# EAGLE design Hub_03 (EAGLE 9.6.2)
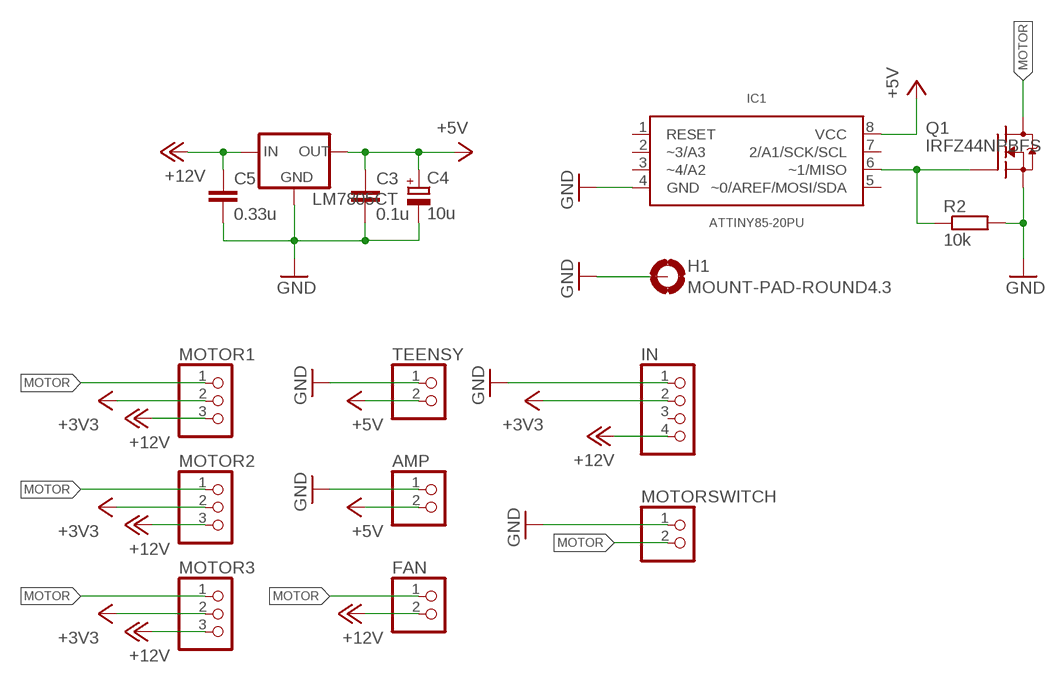
[diagram p0: schematic, sheet 1]

## Parts
AMP  PINHD-1X2  [1X02]
C3  0.1u  C-EU025-024X044  [C025-024X044]
C4  10u  CPOL-EUE2,5-6E  [E2,5-6E]
C5  0.33u  C-EU025-024X044  [C025-024X044]
FAN  PINHD-1X2  [1X02]
H1  MOUNT-PAD-ROUND4.3  [4,3-PAD]
IC1  ATTINY85-20PU  [DIP08]
IN  PINHD-1X4  [1X04]
LM7805CT  78XXS  [78XXS]
MOTOR1  PINHD-1X3  [1X03]
MOTOR2  PINHD-1X3  [1X03]
MOTOR3  PINHD-1X3  [1X03]
MOTORSWITCH  PINHD-1X2  [1X02]
Q1  IRFZ44NPBFS  [TO220-3S]
R2  10k  R-EU_0204/7  [0204/7]
TEENSY  PINHD-1X2  [1X02]

## Nets
+3V3: IN.2 MOTOR1.2 MOTOR2.2 MOTOR3.2
+5V [5V]: AMP.2 C3.1 C4.+ IC1.8(VCC) LM7805CT.OUT TEENSY.2
+12V [12V]: C5.1 FAN.2 IN.4 LM7805CT.IN MOTOR1.3 MOTOR2.3 MOTOR3.3
GND [GND]: AMP.1 C3.2 C4.- C5.2 H1.B4,3(MOUNT) IC1.4(GND) IN.1 LM7805CT.GND MOTORSWITCH.1 Q1.S R2.2 TEENSY.1
MOTOR [GND]: FAN.1 MOTOR1.1 MOTOR2.1 MOTOR3.1 MOTORSWITCH.2 Q1.D
N$1: IC1.6(~1/MISO) Q1.G R2.1
Unconnected: IC1.1(RESET) IC1.2(~3/A3) IC1.3(~4/A2) IC1.5(~0/AREF/MOSI/SDA) IC1.7(2/A1/SCK/SCL) IN.3

## Library data of the parts
AMP FAN MOTORSWITCH TEENSY = pinhead:PINHD-1X2: PIN HEADER
C3 C5 = rcl:C-EU: CAPACITOR, European symbol; SPICEPREFIX: C
C4 = rcl:CPOL-EU: POLARIZED CAPACITOR, European symbol; SPICEPREFIX: C
H1 = holes:MOUNT-PAD-ROUND: MOUNTING PAD, round
IC1 = Programmer:ATTINY85-20PU
IN = pinhead:PINHD-1X4: PIN HEADER
LM7805CT = v-reg:78XXS: VOLTAGE REGULATOR
MOTOR1-MOTOR3 = pinhead:PINHD-1X3: PIN HEADER
Q1 = Programmer:IRFZ44NPBF
R2 = rcl:R-EU_: RESISTOR, European symbol; SPICEPREFIX: R

## Net classes
0 3V3: width 0.203 mm, drill 0.203 mm, clearance 0.152 mm
1 GND: width 0.203 mm, clearance 0.152 mm
2 12V: width 0.813 mm, clearance 0.305 mm
3 5V: width 0.406 mm, clearance 0.152 mm

## Board
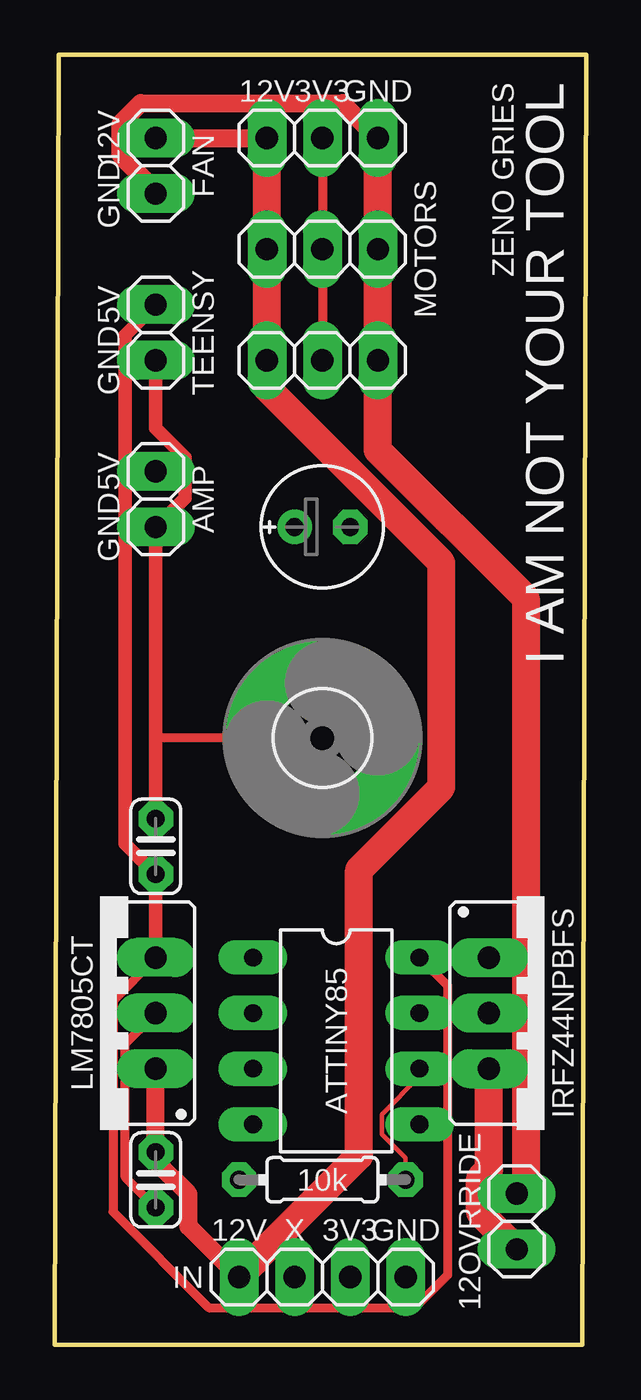
[diagram p1: board, top side]
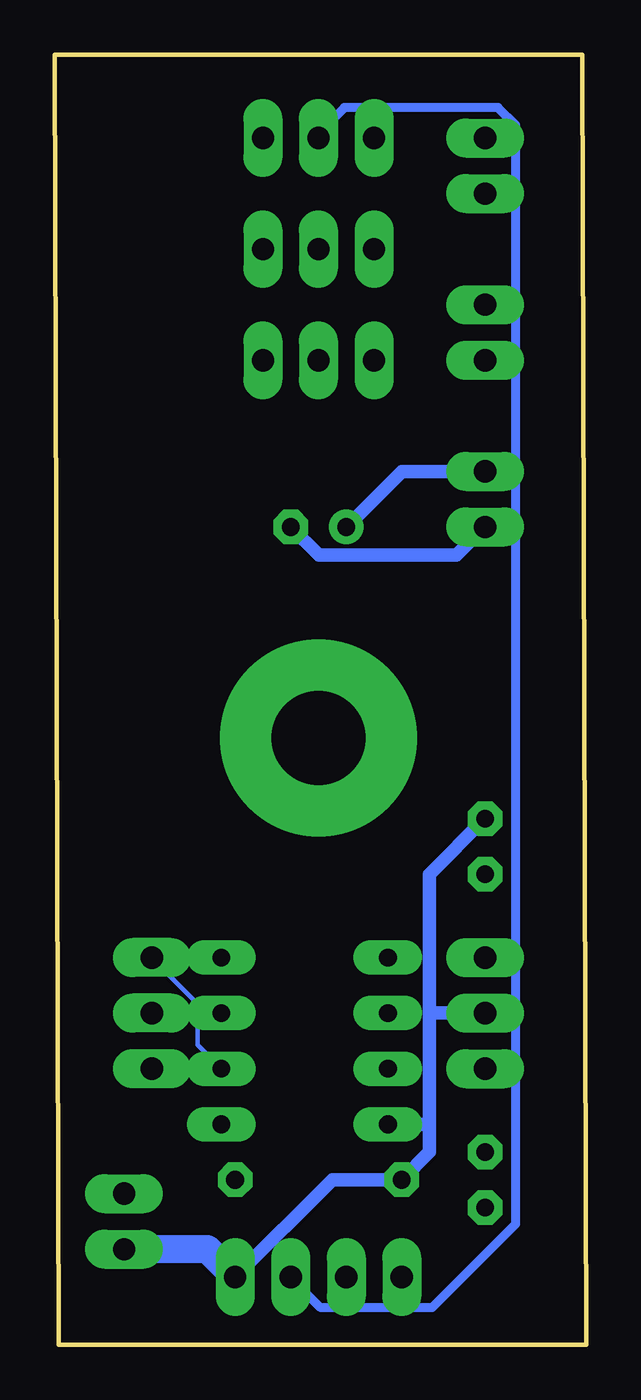
[diagram p2: board, bottom side, seen from below]

Size 24.31 x 58.98 mm. Coordinates in mm from the lower left corner, seen from the top.
Outline: 24.13,0 0,0 0.18,58.98 24.31,58.98 24.13,0
Copper layers (1*16): Top 0.035mm / dielectric 1.5mm / Bottom 0.035mm
Design rules "default *": minimum track width 6mil, minimum drill 0.35mm, track to track 6mil, track to pad 6mil, pad to pad 6mil, via to via 6mil, smd to smd 6mil, copper to edge 40mil, drill to drill 6mil, minimum pad ring 15mil, minimum via ring 8mil, stop-mask expansion 4mil, vias tented up to drill 0mil, thermal gap 10mil

### Footprints (pad centres in the part's own frame; a part is rotated, then mirrored left to right if it is on the bottom)
1X02 = drill 1.016 long: 1 -1.27,0; 2 1.27,0
C025-024X044 = drill 0.813 octagon: 1 -1.27,0; 2 1.27,0
E2,5-6E = drill 0.813 pad 1.575: + -1.27,0 | drill 0.813 pad 1.575 octagon: - 1.27,0
4,3-PAD = drill 4.3 pad 9: B4,3 0,0
DIP08 = drill 0.813 long: 1 -3.81,-3.81; 2 -1.27,-3.81; 3 1.27,-3.81; 4 3.81,-3.81; 5 3.81,3.81; 6 1.27,3.81; 7 -1.27,3.81; 8 -3.81,3.81
1X04 = drill 1.016 long: 1 -3.81,0; 2 -1.27,0; 3 1.27,0; 4 3.81,0
78XXS = drill 1.016 long: GND 0,-2.54; IN -2.54,-2.54; OUT 2.54,-2.54
1X03 = drill 1.016 long: 1 -2.54,0; 2 0,0; 3 2.54,0
TO220-3S = drill 1.016 long: D 0,-2.54; G -2.54,-2.54; S 2.54,-2.54
0204/7 = drill 0.813 octagon: 1 -3.81,0; 2 3.81,0

### Placement (x,y rotation side)
AMP  4.62,38.66 90 top
C3  4.62,22.78 90 top
C4  12.24,37.39 0 top
C5  4.62,7.54 270 top
FAN  4.62,53.9 90 top
H1  12.24,27.74 0 top
IC1  12.88,13.89 270 top
IN  12.24,3.1 180 top
LM7805CT  2.08,15.16 90 top
MOTOR1  12.24,55.17 180 top
MOTOR2  12.24,50.09 180 top
MOTOR3  12.24,45.01 180 top
MOTORSWITCH  21.13,5.64 90 top
Q1  22.4,15.16 270 top
R2  12.24,7.54 180 top
TEENSY  4.62,46.28 90 top

### Tracks (layer width: path | path; a pad name or v marks a point on that pad's centre or on a via)
+3V3
  Top 0.406: MOTOR1.2 MOTOR2.2 MOTOR3.2
  Bottom 0.406: MOTOR1.2 12.24,55.38 11.06,56.57 4.03,56.57 3.23,55.76 3.23,5.53 7.05,1.7 12.14,1.7 13.51,3.07 IN.2
+5V
  Top 0.406: LM7805CT.OUT 4.62,17.68 2.67,15.73 2.67,6.08 7.05,1.7 16.49,1.7 17.98,3.2 17.98,16.41 IC1.8
  Top 0.61: LM7805CT.OUT C3.1 3.23,22.91 3.23,39.93 | TEENSY.2 3.23,46.15 3.23,39.93 | AMP.2 3.23,39.93
  Bottom 0.61: AMP.2 8.43,39.93 C4.+
+12V
  Top 0.813: FAN.2 MOTOR1.3 | IN.4 6.12,5.41 6.12,6.89 4.62,8.39 C5.1 LM7805CT.IN
  Top 1.27: IN.4 9.14,3.81 9.14,3.86 13.92,8.63 13.92,21.72 17.68,25.48 17.68,35.76 9.7,43.74 MOTOR3.3 MOTOR2.3 MOTOR1.3
GND
  Top 0.406: H1.B4,3 4.75,27.74 4.62,27.86 | LM7805CT.GND 3.23,13.76 3.23,7.66 4.61,6.27 C5.2
  Top 0.61: C3.2 4.62,27.86 AMP.1 4.64,37.39 5.97,38.71 5.97,40.56 4.62,41.9 TEENSY.1
  Top 1.27: Q1.S 19.86,8.01 19.46,7.6 19.46,6.04 MOTORSWITCH.1
  Bottom 0.61: AMP.1 4.64,37.39 5.94,36.09 12.22,36.09 C4.- | IN.1 11.61,7.54 R2.2 7.16,8.81 7.16,10.08 | C3.2 7.16,21.51 7.16,15.16 | 7.16,10.08 7.16,15.16 | LM7805CT.GND 7.16,15.16 | 7.16,10.08 IC1.4
  Bottom 1.27: IN.1 17.32,4.37 MOTORSWITCH.1
MOTOR
  Top 0.813: MOTOR1.1 14.77,55.17 13.17,56.77 3.94,56.77 3.02,55.85 3.02,54.36 4.62,52.76 FAN.1
  Top 1.27: 21.54,15.16 21.54,34.13 14.78,40.89 MOTOR3.1 MOTOR2.1 14.78,55.15 14.77,55.17 | 21.54,15.16 21.54,7.31 MOTORSWITCH.2 | Q1.D 21.54,15.16
N$1
  Top 0.203: R2.1 16.05,8.54 14.96,9.63 14.96,10.54 16.69,12.26 IC1.6
  Bottom 0.203: IC1.6 17.78,13.72 17.78,15.6 19.86,17.68 Q1.G

### Text on the board
tPlace: ZENO GRIES
tNames: I AM NOT YOUR TOOL | 12V | 3V3 | GND | 12V | GND | MOTORS | 5V | GND | 5V | GND | ATTINY85 | 12V | X | 3V3 | GND | 12OVRRIDE | IN